# EAGLE schematic fmc1 (EAGLE 7.5.0)
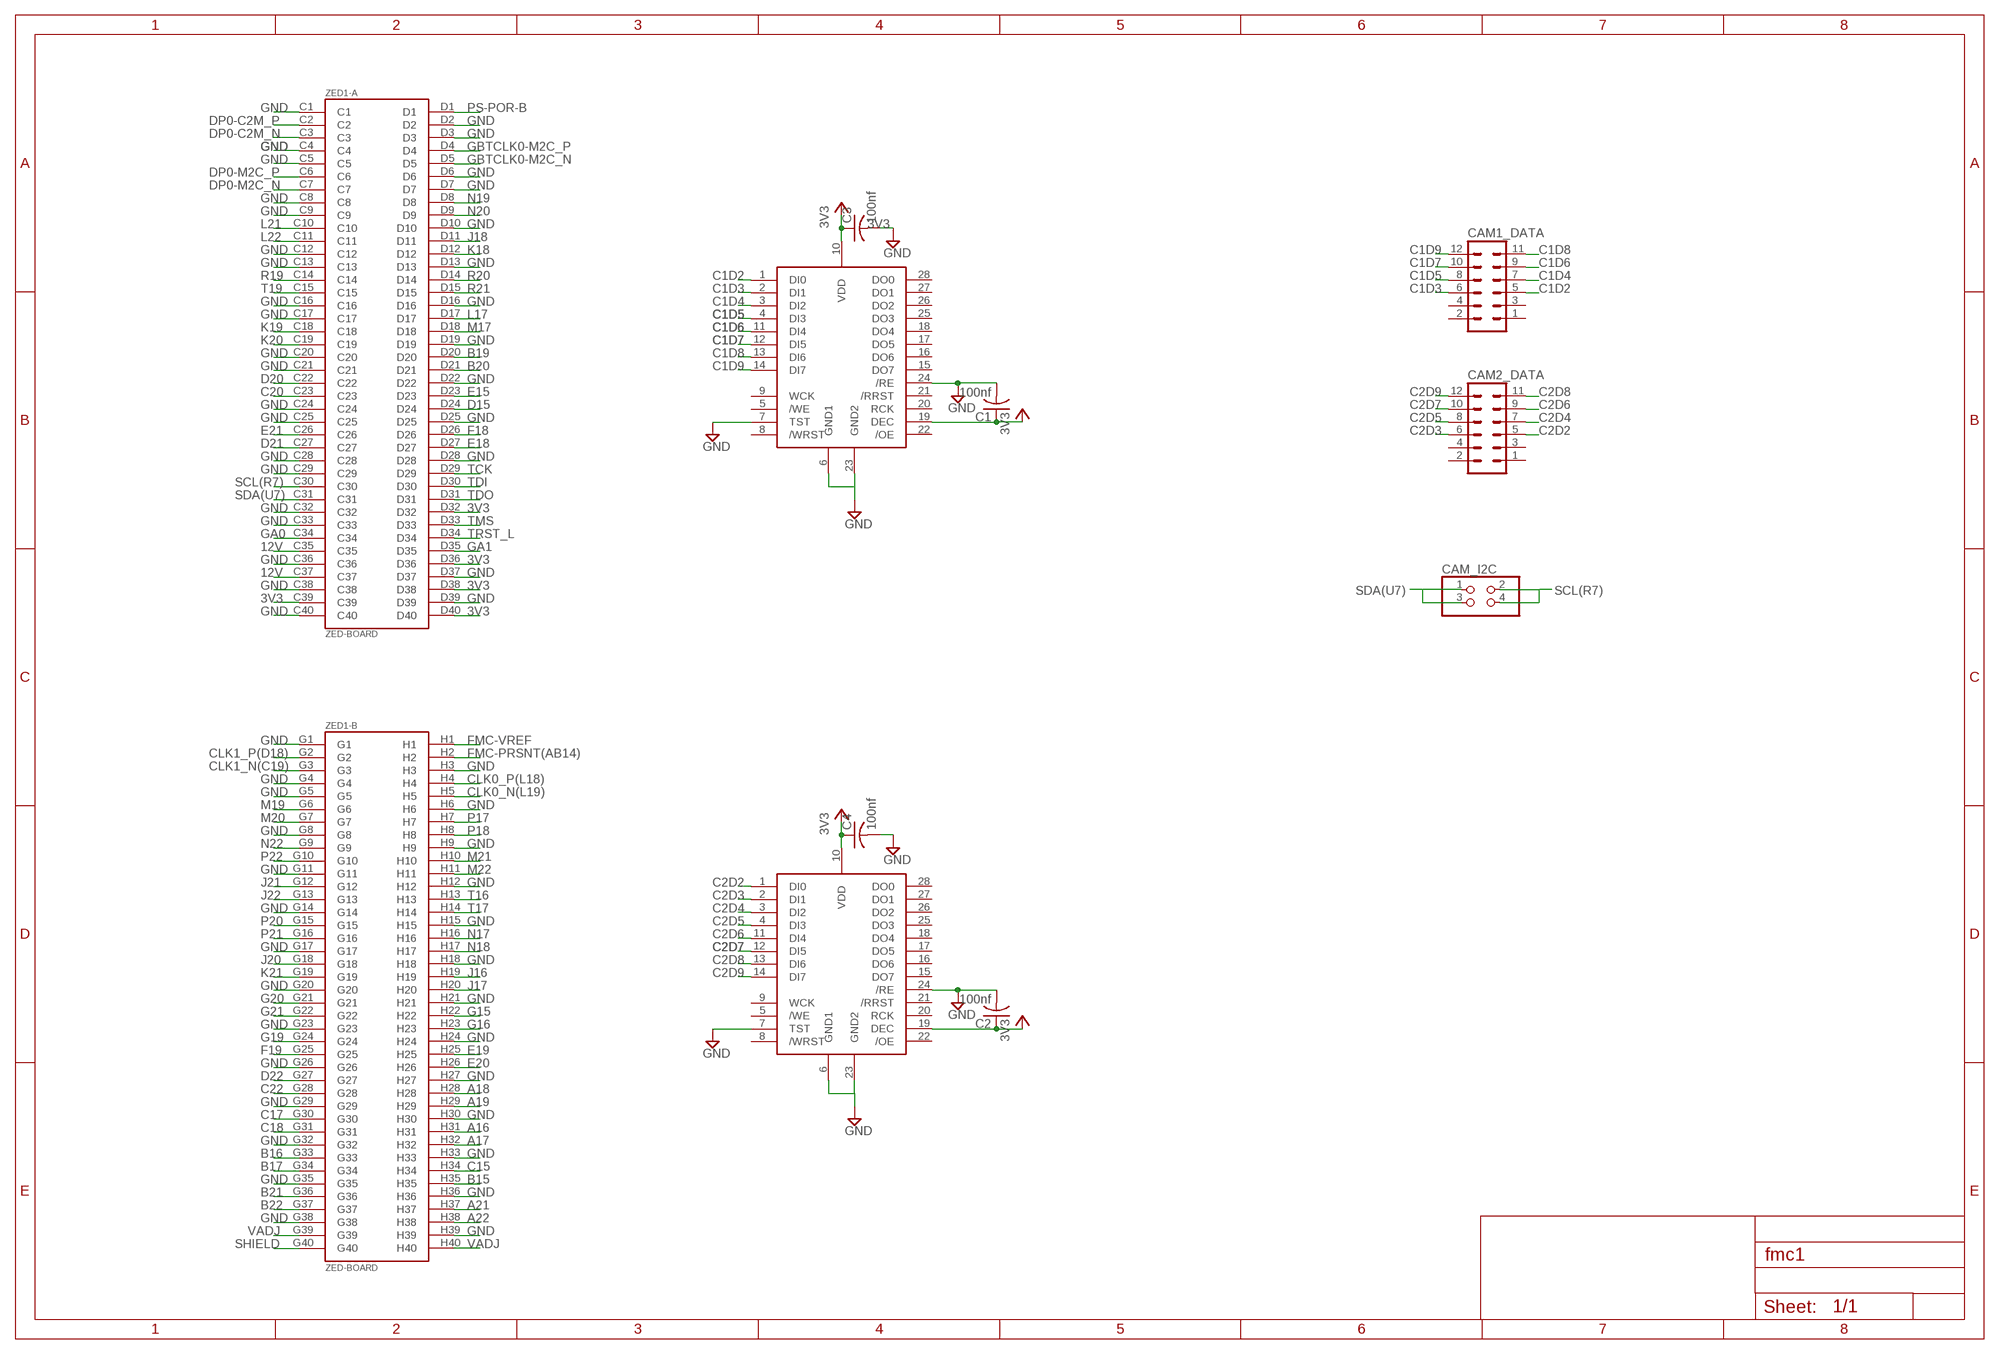
[diagram p0: schematic, sheet 1]

## Parts
AL422B  AL422B  [SOP28]
C1  100nf  C-US025-024X044  [C025-024X044]
C2  100nf  C-US025-024X044  [C025-024X044]
C3  100nf  C-US025-024X044  [C025-024X044]
C4  100nf  C-US025-024X044  [C025-024X044]
CAM1_DATA  MA06-2  [MA06-2]
CAM2_DATA  MA06-2  [MA06-2]
CAM_I2C  PINHD-2X2  [2X02]
U$2  AL422B  [SOP28]
ZED1  ZED-BOARD  [ASP-134604-01]

## Nets
3V3: AL422B.10(VDD) C3.1 C4.1 U$2.10(VDD) ZED1.C39(-A:C39) ZED1.D32(-A:D32) ZED1.D36(-A:D36) ZED1.D38(-A:D38) ZED1.D40(-A:D40)
12V: ZED1.C35(-A:C35) ZED1.C37(-A:C37)
+3V3: AL422B.19(DEC) C1.1 C2.1 U$2.19(DEC) ; supply symbol labelled 3V3
A16: ZED1.H31(-B:H31)
A17: ZED1.H32(-B:H32)
A18: ZED1.H28(-B:H28)
A19: ZED1.H29(-B:H29)
A21: ZED1.H37(-B:H37)
A22: ZED1.H38(-B:H38)
B15: ZED1.H35(-B:H35)
B16: ZED1.G33(-B:G33)
B17: ZED1.G34(-B:G34)
B19: ZED1.D20(-A:D20)
B20: ZED1.D21(-A:D21)
B21: ZED1.G36(-B:G36)
B22: ZED1.G37(-B:G37)
C1D2: AL422B.1(DI0) CAM1_DATA.5
C1D3: AL422B.2(DI1) CAM1_DATA.6
C1D4: AL422B.3(DI2) CAM1_DATA.7
C1D5: AL422B.4(DI3) CAM1_DATA.8
C1D6: AL422B.11(DI4) CAM1_DATA.9
C1D7: AL422B.12(DI5) CAM1_DATA.10
C1D8: AL422B.13(DI6) CAM1_DATA.11
C1D9: AL422B.14(DI7) CAM1_DATA.12
C2D2: CAM2_DATA.5 U$2.1(DI0)
C2D3: CAM2_DATA.6 U$2.2(DI1)
C2D4: CAM2_DATA.7 U$2.3(DI2)
C2D5: CAM2_DATA.8 U$2.4(DI3)
C2D6: CAM2_DATA.9 U$2.11(DI4)
C2D7: CAM2_DATA.10 U$2.12(DI5)
C2D8: CAM2_DATA.11 U$2.13(DI6)
C2D9: CAM2_DATA.12 U$2.14(DI7)
C15: ZED1.H34(-B:H34)
C17: ZED1.G30(-B:G30)
C18: ZED1.G31(-B:G31)
C20: ZED1.C23(-A:C23)
C22: ZED1.G28(-B:G28)
CLK0_N(L19): ZED1.H5(-B:H5)
CLK0_P(L18): ZED1.H4(-B:H4)
CLK1_N(C19): ZED1.G3(-B:G3)
CLK1_P(D18): ZED1.G2(-B:G2)
D15: ZED1.D24(-A:D24)
D20: ZED1.C22(-A:C22)
D21: ZED1.C27(-A:C27)
D22: ZED1.G27(-B:G27)
DP0-C2M_N: ZED1.C3(-A:C3)
DP0-C2M_P: ZED1.C2(-A:C2)
DP0-M2C_N: ZED1.C7(-A:C7)
DP0-M2C_P: ZED1.C6(-A:C6)
E15: ZED1.D23(-A:D23)
E18: ZED1.D27(-A:D27)
E19: ZED1.H25(-B:H25)
E20: ZED1.H26(-B:H26)
E21: ZED1.C26(-A:C26)
F18: ZED1.D26(-A:D26)
F19: ZED1.G25(-B:G25)
FMC-PRSNT(AB14): ZED1.H2(-B:H2)
FMC-VREF: ZED1.H1(-B:H1)
G15: ZED1.H22(-B:H22)
G16: ZED1.H23(-B:H23)
G19: ZED1.G24(-B:G24)
G20: ZED1.G21(-B:G21)
G21: ZED1.G22(-B:G22)
GA0: ZED1.C34(-A:C34)
GA1: ZED1.D35(-A:D35)
GBTCLK0-M2C_N: ZED1.D5(-A:D5)
GBTCLK0-M2C_P: ZED1.D4(-A:D4)
GND: AL422B.6(GND1) AL422B.7(TST) AL422B.23(GND2) AL422B.24(/RE) C1.2 C2.2 C3.2 C4.2 U$2.6(GND1) U$2.7(TST) U$2.23(GND2) U$2.24(/RE) ZED1.C1(-A:C1) ZED1.C4(-A:C4) ZED1.C5(-A:C5) ZED1.C8(-A:C8) ZED1.C9(-A:C9) ZED1.C12(-A:C12) ZED1.C13(-A:C13) ZED1.C16(-A:C16) ZED1.C17(-A:C17) ZED1.C20(-A:C20) ZED1.C21(-A:C21) ZED1.C24(-A:C24) ZED1.C25(-A:C25) ZED1.C28(-A:C28) ZED1.C29(-A:C29) ZED1.C32(-A:C32) ZED1.C33(-A:C33) ZED1.C36(-A:C36) ZED1.C38(-A:C38) ZED1.C40(-A:C40) ZED1.D2(-A:D2) ZED1.D3(-A:D3) ZED1.D6(-A:D6) ZED1.D7(-A:D7) ZED1.D10(-A:D10) ZED1.D13(-A:D13) ZED1.D16(-A:D16) ZED1.D19(-A:D19) ZED1.D22(-A:D22) ZED1.D25(-A:D25) ZED1.D28(-A:D28) ZED1.D37(-A:D37) ZED1.D39(-A:D39) ZED1.G1(-B:G1) ZED1.G4(-B:G4) ZED1.G5(-B:G5) ZED1.G8(-B:G8) ZED1.G11(-B:G11) ZED1.G14(-B:G14) ZED1.G17(-B:G17) ZED1.G20(-B:G20) ZED1.G23(-B:G23) ZED1.G26(-B:G26) ZED1.G29(-B:G29) ZED1.G32(-B:G32) ZED1.G35(-B:G35) ZED1.G38(-B:G38) ZED1.H3(-B:H3) ZED1.H6(-B:H6) ZED1.H9(-B:H9) ZED1.H12(-B:H12) ZED1.H15(-B:H15) ZED1.H18(-B:H18) ZED1.H21(-B:H21) ZED1.H24(-B:H24) ZED1.H27(-B:H27) ZED1.H30(-B:H30) ZED1.H33(-B:H33) ZED1.H36(-B:H36) ZED1.H39(-B:H39)
J16: ZED1.H19(-B:H19)
J17: ZED1.H20(-B:H20)
J18: ZED1.D11(-A:D11)
J20: ZED1.G18(-B:G18)
J21: ZED1.G12(-B:G12)
J22: ZED1.G13(-B:G13)
K18: ZED1.D12(-A:D12)
K19: ZED1.C18(-A:C18)
K20: ZED1.C19(-A:C19)
K21: ZED1.G19(-B:G19)
L17: ZED1.D17(-A:D17)
L21: ZED1.C10(-A:C10)
L22: ZED1.C11(-A:C11)
M17: ZED1.D18(-A:D18)
M19: ZED1.G6(-B:G6)
M20: ZED1.G7(-B:G7)
M21: ZED1.H10(-B:H10)
M22: ZED1.H11(-B:H11)
N17: ZED1.H16(-B:H16)
N18: ZED1.H17(-B:H17)
N19: ZED1.D8(-A:D8)
N20: ZED1.D9(-A:D9)
N22: ZED1.G9(-B:G9)
P17: ZED1.H7(-B:H7)
P18: ZED1.H8(-B:H8)
P20: ZED1.G15(-B:G15)
P21: ZED1.G16(-B:G16)
P22: ZED1.G10(-B:G10)
PS-POR-B: ZED1.D1(-A:D1)
R19: ZED1.C14(-A:C14)
R20: ZED1.D14(-A:D14)
R21: ZED1.D15(-A:D15)
SCL(R7): CAM_I2C.2 CAM_I2C.4 ZED1.C30(-A:C30)
SDA(U7): CAM_I2C.1 CAM_I2C.3 ZED1.C31(-A:C31)
SHIELD: ZED1.G40(-B:G40)
T16: ZED1.H13(-B:H13)
T17: ZED1.H14(-B:H14)
T19: ZED1.C15(-A:C15)
TCK: ZED1.D29(-A:D29)
TDI: ZED1.D30(-A:D30)
TDO: ZED1.D31(-A:D31)
TMS: ZED1.D33(-A:D33)
TRST_L: ZED1.D34(-A:D34)
VADJ: ZED1.G39(-B:G39) ZED1.H40(-B:H40)
Unconnected: AL422B.5(/WE) AL422B.8(/WRST) AL422B.9(WCK) AL422B.15(DO7) AL422B.16(DO6) AL422B.17(DO5) AL422B.18(DO4) AL422B.20(RCK) AL422B.21(/RRST) AL422B.22(/OE) AL422B.25(DO3) AL422B.26(DO2) AL422B.27(DO1) AL422B.28(DO0) CAM1_DATA.1 CAM1_DATA.2 CAM1_DATA.3 CAM1_DATA.4 CAM2_DATA.1 CAM2_DATA.2 CAM2_DATA.3 CAM2_DATA.4 U$2.5(/WE) U$2.8(/WRST) U$2.9(WCK) U$2.15(DO7) U$2.16(DO6) U$2.17(DO5) U$2.18(DO4) U$2.20(RCK) U$2.21(/RRST) U$2.22(/OE) U$2.25(DO3) U$2.26(DO2) U$2.27(DO1) U$2.28(DO0)

## Library data of the parts
AL422B U$2 = AL422B:AL422B: Averlogic AL422B 3Mbit FIFO
C1-C4 = rcl:C-US: CAPACITOR, American symbol
CAM1_DATA CAM2_DATA = con-lstb:MA06-2: PIN HEADER; OC_FARNELL: unknown; OC_NEWARK: unknown
CAM_I2C = pinhead:PINHD-2X2: PIN HEADER
ZED1 = zed-board:ZED-BOARD